# Altium schematic sheet connectors.SchDoc
size A4; SheetNumber: 6; SheetTotal: 6
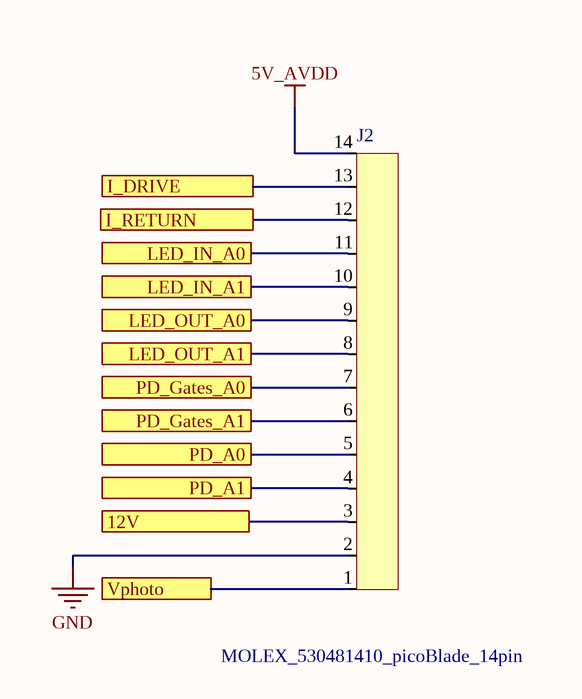
[diagram p0: connectors.SchDoc]

## Parts
J2  MOLEX_530481410_picoBlade_14pin  [MOLEX_530481410_picoBlade_14pin]

## Ports
12V, I_DRIVE, I_RETURN, LED_IN_A0, LED_IN_A1, LED_OUT_A0, LED_OUT_A1, PD_A0, PD_A1, PD_Gates_A0, PD_Gates_A1, Vphoto

## Nets
5V_AVDD: J2.14
GND: J2.2
12V: J2.3 ; port 12V
I_DRIVE: J2.13 ; port I_DRIVE
I_RETURN: J2.12 ; port I_RETURN
LED_IN_A0: J2.11 ; port LED_IN_A0
LED_IN_A1: J2.10 ; port LED_IN_A1
LED_OUT_A0: J2.9 ; port LED_OUT_A0
LED_OUT_A1: J2.8 ; port LED_OUT_A1
PD_A0: J2.5 ; port PD_A0
PD_A1: J2.4 ; port PD_A1
PD_Gates_A0: J2.7 ; port PD_Gates_A0
PD_Gates_A1: J2.6 ; port PD_Gates_A1
Vphoto: J2.1 ; port Vphoto